# EAGLE design NIBB (EAGLE 8.1.0)
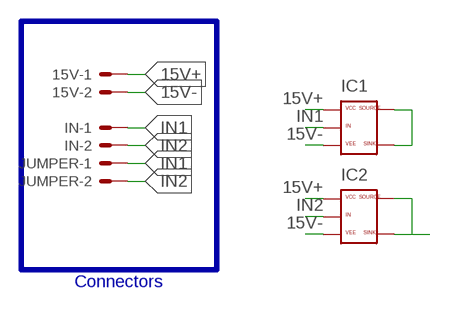
[diagram p0: schematic, sheet 1]

## Parts
15V  22-23-2021  [22-23-2021]
IC1  ZXGD3006E6  [SOT23]
IC2  ZXGD3006E6  [SOT23]
IN  22-23-2021  [22-23-2021]
JUMPER  22-23-2021  [22-23-2021]

## Nets
15V+: 15V.1 IC1.1(VCC) IC2.1(VCC)
15V-: 15V.2 IC1.3(VEE) IC2.3(VEE)
IN1: IC1.2(IN) IN.1 JUMPER.1
IN2: IC2.2(IN) IN.2 JUMPER.2
N$5: IC1.4(SINK) IC1.6(SOURCE)
N$6: IC2.4(SINK) IC2.6(SOURCE)

## Buses
B$1

## Notes on the sheet
- Connectors

## Library data of the parts
15V IN JUMPER = con-molex:22-23-2021: .100" (2.54mm) Center Header - 2 Pin; MF: MOLEX; MPN: 22-23-2021; OC_FARNELL: 1462926; OC_NEWARK: 25C3832
IC1 IC2 = felippe:ZXGD3006E6

## Board
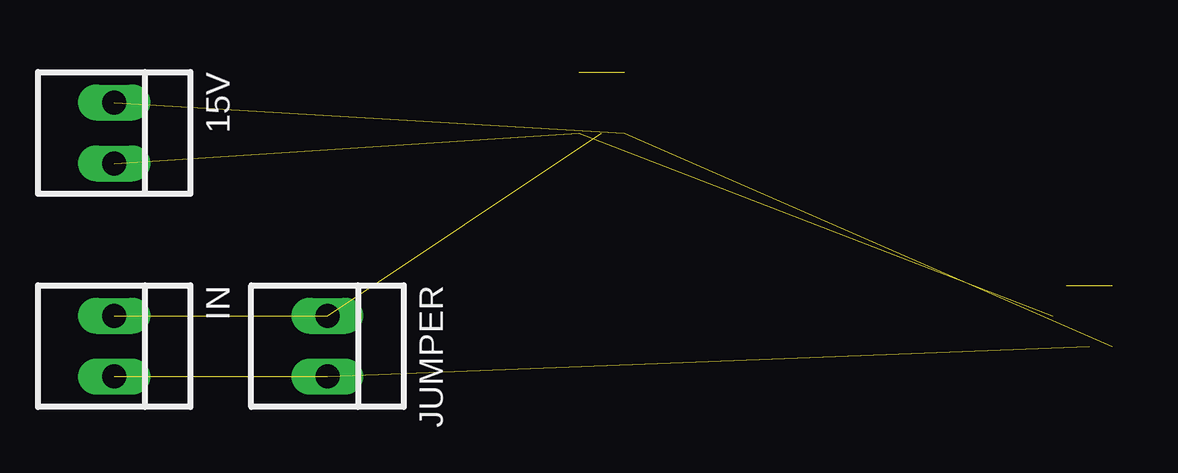
[diagram p1: board, top side]
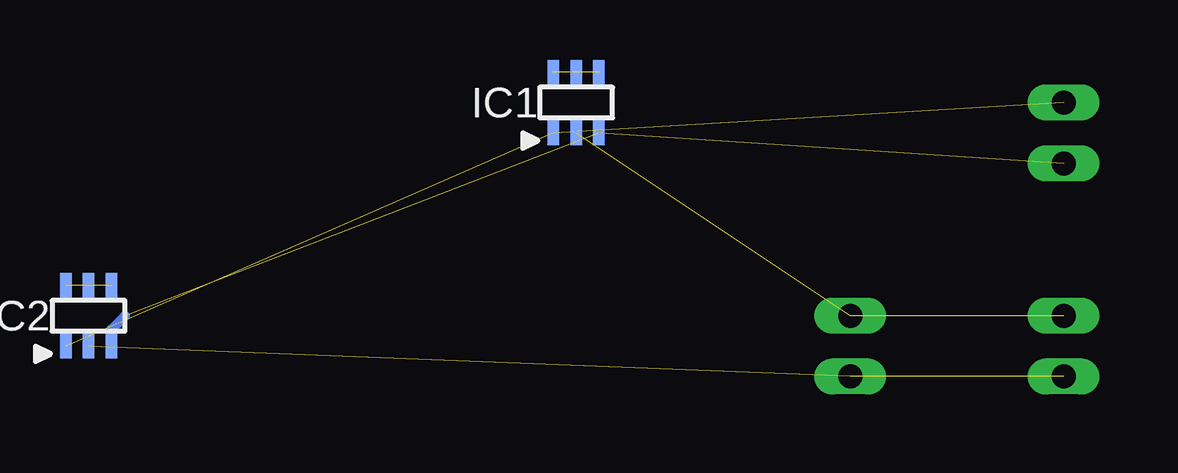
[diagram p2: board, bottom side, seen from below]

No outline drawn. Coordinates in mm, seen from the top.
Copper layers (1*16): Top 0.035mm / dielectric 1.5mm / Bottom 0.035mm
Design rules "default": minimum track width 10mil, minimum drill 24mil, track to track 8mil, track to pad 8mil, pad to pad 8mil, via to via 8mil, smd to smd 8mil, copper to edge 40mil, drill to drill 8mil, minimum pad ring 10mil, minimum via ring 8mil, stop-mask expansion 4mil, vias tented up to drill 0mil, thermal gap 10mil

### Footprints (pad centres in the part's own frame; a part is rotated, then mirrored left to right if it is on the bottom)
22-23-2021 = drill 1 long: 1 -1.27,0; 2 1.27,0
SOT23 = smd 0.483 x 1.016: 1 -0.953,-1.27; 2 0,-1.27; 3 0.953,-1.27; 4 0.953,1.27; 5 0,1.27; 6 -0.953,1.27

### Placement (x,y rotation side)
15V  5.08,16.51 270 top
IC1  25.4,17.78 0 bottom
IC2  45.72,8.89 0 bottom
IN  5.08,7.62 270 top
JUMPER  13.97,7.62 270 top

### Tracks (layer width: path | path; a pad name or v marks a point on that pad's centre or on a via)
15V+  (2 unrouted)
15V-  (2 unrouted)
  Bottom 0.406: 44.2,8.89 44.77,8.32 IC2.3
IN1  (2 unrouted)
IN2  (2 unrouted)
N$5  (1 unrouted)
N$6  (1 unrouted)